# EAGLE design main (EAGLE 6.5.0)
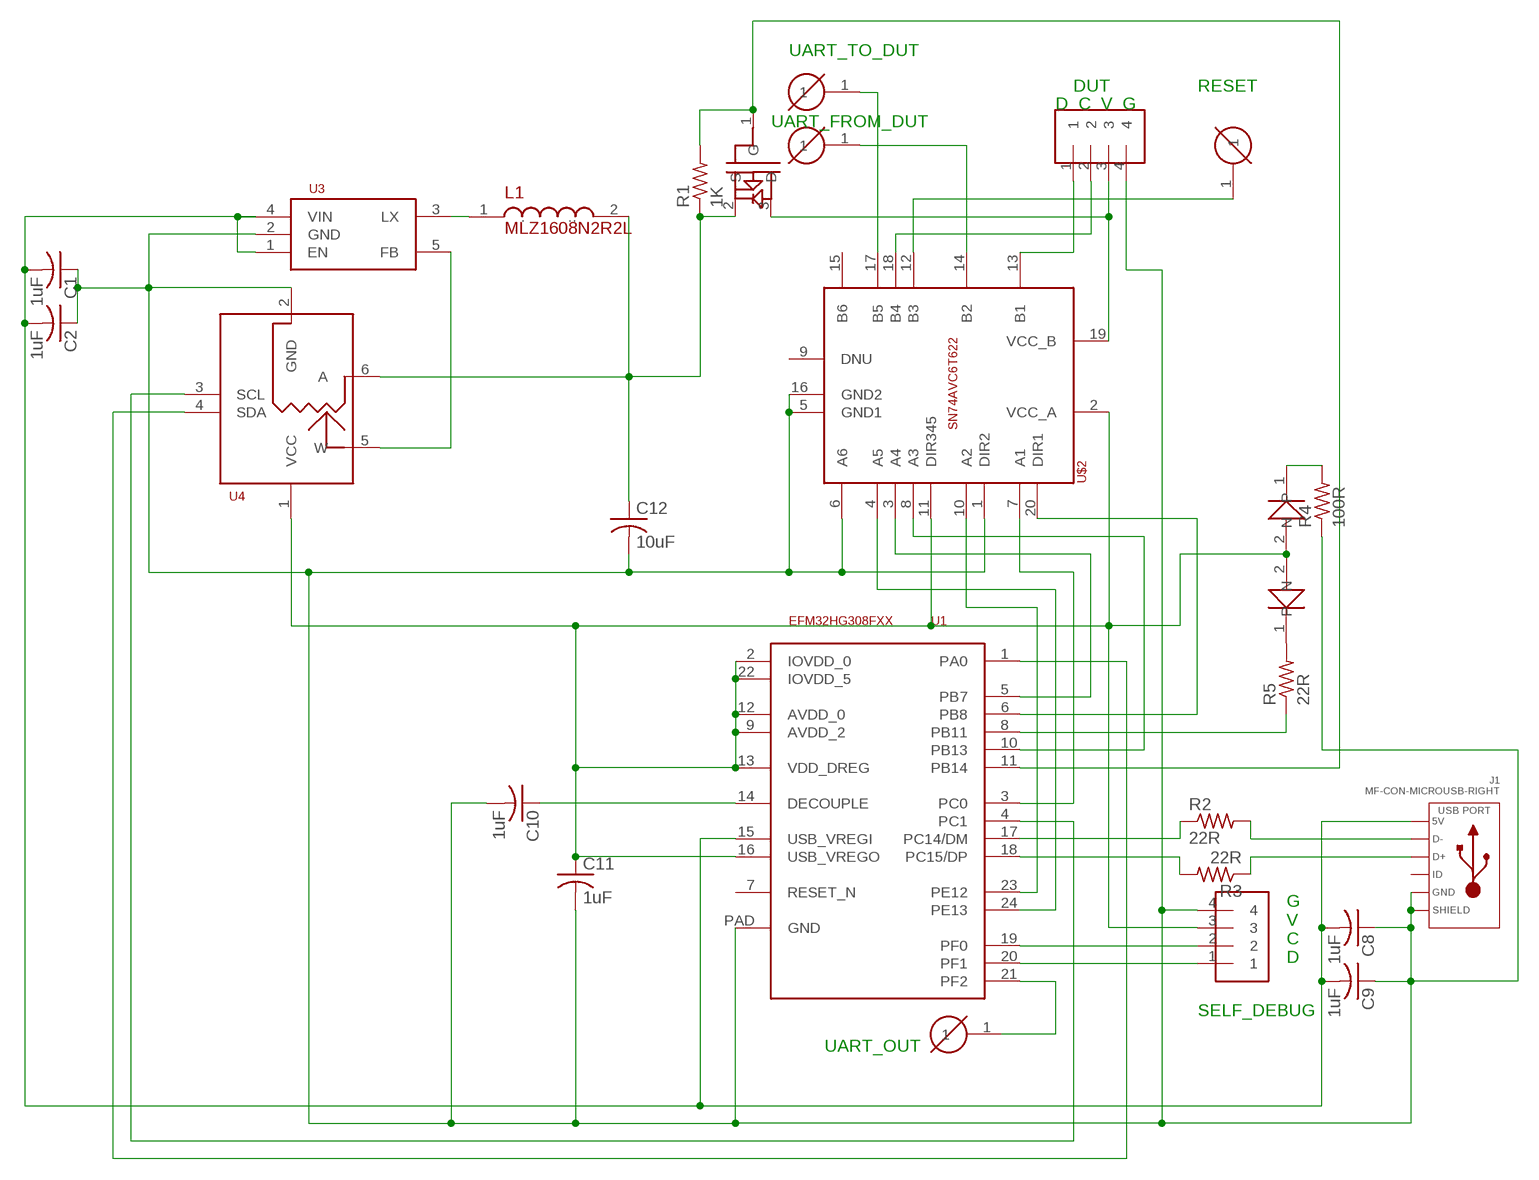
[diagram p0: schematic, sheet 1]

## Parts
C1  1uF  C-USC0402K  [C0402K]
C2  1uF  C-USC0402K  [C0402K]
C8  1uF  C-USC0402K  [C0402K]
C9  1uF  C-USC0402K  [C0402K]
C10  1uF  C-USC0402K  [C0402K]
C11  1uF  C-USC0402K  [C0402K]
C12  10uF  C-USC1206K  [C1206K]
CN_RST  PTH_PIN  [PTH_PIN]
CN_RX  PTH_PIN  [PTH_PIN]
CN_TX  PTH_PIN  [PTH_PIN]
CONN_OUT  PIN_HEADER_4X1POLARIZED  [PIN_HEADER_4X1_POLARIZED]
CONN_SELF  PIN_HEADER_4X1POLARIZED  [PIN_HEADER_4X1_POLARIZED]
D1-PWR  LED0805  [0805]
D2-ACT  LED0805  [0805]
J1  MF-CON-MICROUSB-RIGHT  USB_MICRO_RIGHT  [MICROUSB-RIGHT]
L1  MLZ1608N2R2L  [0603]
R1  1K  R-US_R0402  [R0402]
R2  22R  R-US_R0402  [R0402]
R3  22R  R-US_R0402  [R0402]
R4  100R  R-US_R0402  [R0402]
R5  22R  R-US_R0402  [R0402]
TP_UART_OUT  PTH_PIN  [PTH_PIN]
U1  EFM32HG308FXX  [QFN26-0.65]
U3  AP3417C  [SOT23]
U4  MCP4018  [SC-70-6]
U$1  PMV50UPE  [SOT23-3]
U$2  SN74AVC6T622  [VQFN-20]

## Nets
DEBUG_UART_DI: U1.23(PE12) U$2.10(A2)
DEBUG_UART_DO: U1.24(PE13) U$2.4(A5)
DUT_RESET: CN_RST.1 U$2.12(B3)
DUT_SWDCK: CONN_OUT.2 U$2.18(B4)
DUT_SWDIO: CONN_OUT.1 U$2.13(B1)
GND: C1.1 C2.1 C8.1 C9.1 C10.2 C11.2 C12.2 CONN_OUT.4 CONN_SELF.4 J1.5(GND) J1.S1(SLD) J1.S2(SLD) J1.S3(SLD) J1.S4(SLD) J1.S5(SLD) J1.S6(SLD) R4.1 U1.PAD(GND) U3.2(GND) U4.2(GND) U$2.1(DIR2) U$2.5(GND1) U$2.6(A6) U$2.16(GND2)
LED_ACT_1: R5.1 U1.8(PB11)
N$1: C10.1 U1.14(DECOUPLE)
N$4: TP_UART_OUT.1 U1.21(PF2)
N$6: D2-ACT.1(N) R5.2
N$7: D1-PWR.1(N) R4.2
OUT_RESET: U1.10(PB13) U$2.8(A3)
OUT_SWDCK: U1.5(PB7) U$2.3(A4)
OUT_SWDIO: U1.3(PC0) U$2.7(A1)
OUT_SWDIO_DIRCTL: U1.6(PB8) U$2.20(DIR1)
REG_FB: U3.5(FB) U4.5(W)
REG_LX: L1.1(.) U3.3(LX)
SCL: U1.4(PC1) U4.3(SCL)
SDA: U1.1(PA0) U4.4(SDA)
SELF_SWDCK: CONN_SELF.2 U1.19(PF0)
SELF_SWDIO: CONN_SELF.1 U1.20(PF1)
SUPPLY_POWER_EN: R1.2 U1.11(PB14) U$1.1(G)
UART_RX_FROM_DUT: CN_RX.1 U$2.14(B2)
UART_TX_TO_DUT: CN_TX.1 U$2.17(B5)
USB_DM: R2.1 U1.17(PC14/DM)
USB_DM_1: J1.2(D-) R2.2
USB_DP: R3.2 U1.18(PC15/DP)
USB_DP_1: J1.3(D+) R3.1
V_REGULATED_FOR_DUT: C12.1 L1.2(..) R1.1 U4.6(A) U$1.2(S)
VBUS: C1.2 C2.2 C8.2 C9.2 J1.1(5V) U1.15(USB_VREGI) U3.1(EN) U3.4(VIN)
VCC_3V3: C11.1 CONN_SELF.3 D1-PWR.2(P) D2-ACT.2(P) U1.2(IOVDD_0) U1.9(AVDD_2) U1.12(AVDD_0) U1.13(VDD_DREG) U1.16(USB_VREGO) U1.22(IOVDD_5) U4.1(VCC) U$2.2(VCC_A) U$2.11(DIR345)
VREF: CONN_OUT.3 U$1.3(D) U$2.19(VCC_B)
Unconnected: J1.4(ID) U1.7(RESET_N) U$2.9(DNU) U$2.15(B6)

## Notes on the sheet
- UART_TO_DUT
- DUT | RESET
- D  C  V  G
- UART_FROM_DUT
- G
  V
  C
  D
- SELF_DEBUG
- UART_OUT

## Library data of the parts
C1 C2 C8-C12 = rcl:C-US: CAPACITOR, American symbol
CN_RST CN_RX CN_TX TP_UART_OUT = dmitrygr:PTH_PIN
CONN_OUT CONN_SELF = dmitrygr:PIN_HEADER_4X1
D1-PWR D2-ACT = dmitrygr:LED
J1 = MF_Connectors:USB: Library: MF_Connectors Description: 5 Pin USB Connectors. SLD is the shield connection. Usually tied to ground through a small ferrite bead.; HOUSEPART: YES; MPN: MF-CON-MICROUSB-RIGHT; POPULATE: 1; URL: https://factory.macrofab.com/part/MF-CON-MICROUSB-RIGHT
L1 = dmitrygr:MLZ1608N2R2L
R1-R5 = rcl:R-US_: RESISTOR, American symbol
U1 = dmitrygr:EFM32HG308FXX
U3 = dmitrygr:AP3417C
U4 = dmitrygr:MCP4018
U$1 = dmitrygr:PMV50UPE
U$2 = dmitrygr:SN74AVC6T622

## Board
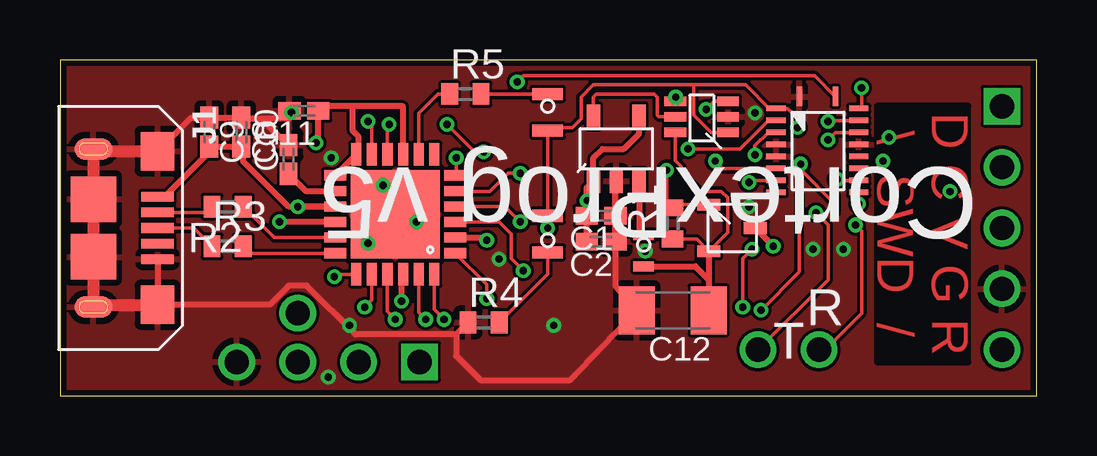
[diagram p1: board, top side]
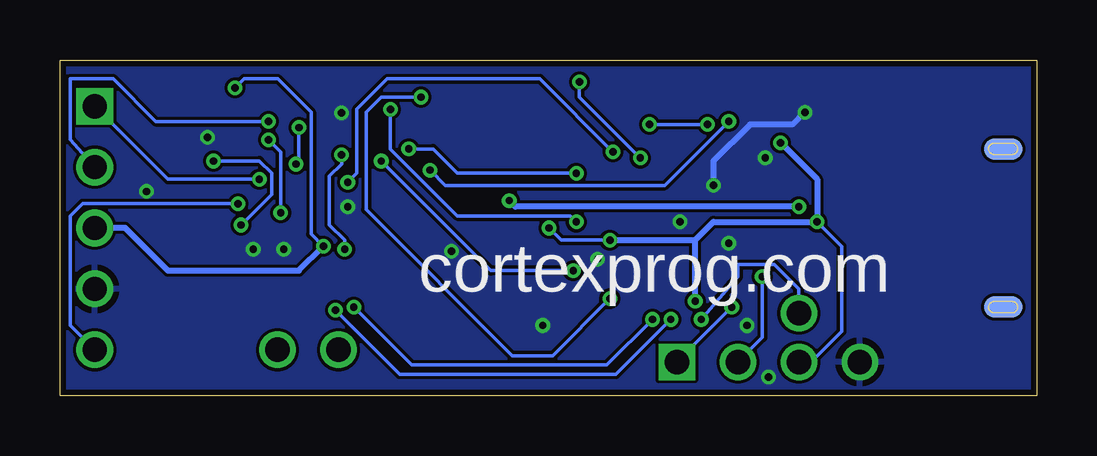
[diagram p2: board, bottom side, seen from below]

Size 40.69 x 14.02 mm. Coordinates in mm from the lower left corner, seen from the top.
Outline: 0,14.02 0,0 40.69,0 40.69,14.02 0,14.02
Copper layers (1*16): Top 0.035mm / dielectric 1.5mm / Bottom 0.035mm
Design rules "MF_Standard_2_Layer": minimum track width 5mil, minimum drill 12mil, track to track 5mil, track to pad 5mil, pad to pad 5mil, via to via 5mil, smd to smd 0mil, copper to edge 10mil, drill to drill 10mil, minimum pad ring 6mil, minimum via ring 6mil, stop-mask expansion 2mil, vias tented up to drill 25mil, thermal gap 10mil

### Footprints (pad centres in the part's own frame; a part is rotated, then mirrored left to right if it is on the bottom)
C0402K = smd 0.925 x 0.74: 1 -0.6,0; 2 0.6,0
C1206K = smd 1.5 x 2: 1 -1.5,0; 2 1.5,0
PTH_PIN = drill 1.016: 1 0,0
PIN_HEADER_4X1_POLARIZED = drill 1.016 square: 1 0,5.08 | drill 1.016: 2 0,2.54; 3 0,0; 4 0,-2.54
0805 = smd 0.508 x 1.27: 1 -0.762,0; 2 0.762,0
MICROUSB-RIGHT = smd 0.4 x 1.35: 1 -1.3,1.27; 2 -0.65,1.27; 3 0,1.27; 4 0.65,1.27; 5 1.3,1.27 | smd 0.9 x 1.6: S1 -3.3,-1.4; S2 3.3,-1.4 | smd 1.6 x 1.4: S3 -3.2,1.27; S4 3.2,1.27 | smd 1.9 x 1.9: S5 -1.2,-1.405; S6 1.2,-1.405 | smd 0.9 x 1.6 bottom: S7 -3.3,-1.4; S8 3.3,-1.4
0603 = smd 0.4 x 0.85: 1 -0.65,0; 2 0.65,0
R0402 = smd 0.7 x 0.9: 1 -0.65,0; 2 0.65,0
QFN26-0.65 = smd 0.92 x 0.42: 1 -2.5,1.625; 2 -2.5,0.975; 3 -2.5,0.325; 4 -2.5,-0.325; 5 -2.5,-0.975; 6 -2.5,-1.625; 13 2.5,-1.625; 14 2.5,-0.975; 15 2.5,-0.325; 16 2.5,0.325; 17 2.5,0.975; 18 2.5,1.625 | smd 0.42 x 0.92: 7 -1.625,-2.5; 8 -0.975,-2.5; 9 -0.325,-2.5; 10 0.325,-2.5; 11 0.975,-2.5; 12 1.625,-2.5; 19 1.625,2.5; 20 0.975,2.5; 21 0.325,2.5; 22 -0.325,2.5; 23 -0.975,2.5; 24 -1.625,2.5 | smd 3.7 x 3.7: PAD 0,0
SOT23 = smd 0.55 x 1: 1 -0.95,-1.35; 2 0,-1.35; 3 0.95,-1.35; 4 0.95,1.35; 5 -0.95,1.35
SC-70-6 = smd 0.9 x 0.4: 1 -1.1,0.65; 2 -1.1,0; 3 -1.1,-0.65; 4 1.1,-0.65; 5 1.1,0; 6 1.1,0.65
SOT23-3 = smd 0.48 x 0.95: 1 0.97,0.97; 2 -0.97,0.97; 3 0,-0.97
VQFN-20 = smd 0.8 x 0.23: 1 -2.25,-0.75; 10 2.25,-0.75; 11 2.25,0.75; 20 -2.25,0.75 | smd 0.23 x 0.8: 2 -1.75,-1.725; 3 -1.25,-1.725; 4 -0.75,-1.725; 5 -0.25,-1.725; 6 0.25,-1.725; 7 0.75,-1.725; 8 1.25,-1.725; 9 1.75,-1.725; 12 1.75,1.725; 13 1.25,1.725; 14 0.75,1.725; 15 0.25,1.725; 16 -0.25,1.725; 17 -0.75,1.725; 18 -1.25,1.725; 19 -1.75,1.725

### Placement (x,y rotation side)
C1  22.54,7.52 180 top
C2  22.54,6.44 180 top
C8  7.56,11.01 270 top
C9  6.22,11.01 270 top
C10  9.53,9.87 90 top
C11  10.16,11.9 180 top
C12  25.53,3.58 180 top
CN_RST  39.24,1.93 270 top
CN_RX  31.62,1.93 270 top
CN_TX  29.08,1.93 270 top
CONN_OUT  39.24,7.01 0 top
CONN_SELF  9.91,1.42 270 top
D1-PWR  20.32,6.76 90 top
D2-ACT  20.32,11.84 270 top
J1  2.79,7.01 270 top
L1  24.32,6.06 270 top
R1  25.53,7.2 90 top
R2  6.99,7.9 180 top
R3  6.99,6.25 0 top
R4  17.65,3.07 0 top
R5  16.89,12.6 0 top
TP_UART_OUT  9.91,3.45 270 top
U1  13.97,7.58 180 top
U3  23.18,10.31 0 top
U4  26.73,11.65 180 top
U$1  28,7.01 90 top
U$2  31.56,10.25 270 top

### Tracks (layer width: path | path; a pad name or v marks a point on that pad's centre or on a via)
DEBUG_UART_DI  (via drill 0.3)
  Top 0.152: U1.23 14.95,3.5 v15.24,3.2 | v29.21,3.58 30.81,5.18 U$2.10
  Bottom 0.152: v15.24,3.2 17.53,0.91 26.54,0.91 v29.21,3.58
DEBUG_UART_DO  (via drill 0.3)
  Top 0.152: U1.24 15.6,3.61 v16,3.2 | v28.96,10.06 28.96,10.44 29.52,11 U$2.4 | v28.83,6.12 28.45,5.74 v28.45,3.71
  Bottom 0.152: v16,3.2 17.91,1.29 26.04,1.29 v28.45,3.71 | v28.96,10.06 28.96,9.68 29.46,9.17 29.46,7.14 28.83,6.5 v28.83,6.12
DUT_RESET  (via drill 0.3)
  Top 0.152: v33.27,8.03 33.28,8.04 U$2.12
  Bottom 0.152: CN_RST.1 40.26,2.95 40.26,7.52 39.75,8.03 v33.27,8.03
DUT_SWDCK  (via drill 0.3)
  Top 0.152: v32,11.46 32.05,11.5 U$2.18
  Bottom 0.152: CONN_OUT.2 40.26,10.69 40.26,13.23 38.48,13.23 36.7,11.46 v32,11.46
DUT_SWDIO  (via drill 0.3)
  Top 0.152: v32.38,9.04 32.56,9 U$2.13
  Bottom 0.152: CONN_OUT.1 36.2,9.04 v32.38,9.04
GND  (via drill 0.3)
  Top 0.152: R4.1 17,3.06 16.51,2.56
  Top 0.254: J1.5 J1.S4 8.74,3.81 9.53,4.6 10.29,4.6 12.32,2.56 16.5,2.56 R4.1 | J1.S3 5.46,11.61 C9.1 C8.1 7.58,11.58 8.38,11.58 | 8.38,11.58 9.5,10.47 C10.2 | 8.38,11.58 9.56,11.58 C11.2 9.62,11.84 v9.65,11.84 | U1.PAD 13.53,8.03 v13.46,8.79 | C12.2 24.41,3.45 | U3.2 23.14,8.93 C1.1 C2.1 23.14,4.59 C12.2 | 16.51,2.56 16.51,1.68 17.53,0.66 21.23,0.66 C12.2
  Top 0.508: J1.S6 J1.S5 J1.S1 1.39,10.21 J1.S3 | J1.S6 J1.S2 | J1.S6 1.39,3.81 J1.S4
  Bottom 0.254: v9.65,11.84 10.16,11.33 11.94,11.33 13.46,9.8 v13.46,8.79
  other vias: 12.06,2.95 11.18,0.79 20.57,2.95 31.37,6.12 32.64,6.12 28.7,7.9 14.86,7.26 11.3,9.93 37.08,8.53 24.38,6.05 12.83,6.38 18.29,5.71 34.54,10.79 28.96,11.81
  pour Top: 0.13,13.74 40.51,13.74 40.51,0.28 0.13,0.28
  pour Bottom: 0.13,13.74 40.51,13.74 40.51,0.28 0.13,0.28
LED_ACT_1
  Top 0.152: U1.8 14.95,11.79 15.75,12.6 R5.1
N$1
  Top 0.254: C10.1 10.24,8.56 U1.14
N$4  (via drill 0.3)
  Top 0.152: U1.21 13.64,3.52 v13.97,3.2
  Bottom 0.152: TP_UART_OUT.1 9.91,4.47 10.92,5.49 12.45,5.49 12.45,4.98 v13.97,3.2
N$6
  Top 0.152: R5.2 D2-ACT.1
N$7
  Top 0.152: R4.2 20.32,5.09 D1-PWR.1
OUT_RESET  (via drill 0.3)
  Top 0.152: U$2.8 28.79,9 v28.7,8.91 | v17.65,10.19 17.27,10.19 v16.13,11.33 | U1.10 13.64,11.26 v13.72,11.33
  Bottom 0.152: v28.7,8.91 28.32,9.3 28.32,11.96 27.05,13.23 20.7,13.23 v17.65,10.19 | 16,11.33 v16.13,11.33 v13.72,11.33
OUT_SWDCK  (via drill 0.3)
  Top 0.152: U1.5 16.49,8.53 17.91,8.53 18.67,9.3 v19.18,9.3 | v26.16,10.31 28.32,10.31 29.51,11.5 U$2.3
  Bottom 0.152: v26.16,10.31 25.15,10.31 24.13,9.3 v19.18,9.3
OUT_SWDIO  (via drill 0.3)
  Top 0.152: v19.3,5.23 18.8,5.74 18.8,6.76 18.3,7.26 U1.3 | v27.3,9.8 27.61,9.5 U$2.7
  Bottom 0.152: v19.3,5.23 22.73,5.23 v27.3,9.8
OUT_SWDIO_DIRCTL  (via drill 0.3)
  Top 0.152: U$2.20 31.45,13.36 19.3,13.36 v19.05,13.11 | v16.51,9.93 16.51,9.25 U1.6
  Bottom 0.152: v19.05,13.11 19.05,12.47 v16.51,9.93
REG_FB
  Top 0.152: U4.5 24.96,11.65 24.89,11.71 24.89,12.47 24.77,12.6 22.35,12.6 22.23,12.47 22.23,12.22 22.23,12.09 U3.5
REG_LX
  Top 0.254: U3.3 24.13,6.71 L1.1
SCL  (via drill 0.3)
  Top 0.152: U4.3 27.26,12.3 v26.92,11.96 | v19.18,7.26 18.54,7.91 U1.4
  Bottom 0.152: v26.92,11.96 26.92,10.31 24.13,7.52 19.43,7.52 v19.18,7.26
SDA  (via drill 0.3)
  Top 0.152: U4.4 25.83,12.3 v25.65,12.47 | U1.1 17.78,4.65 v17.78,4.06
  Bottom 0.152: v25.65,12.47 27.3,12.47 27.94,11.84 27.94,7.77 21.84,1.68 20.17,1.68 v17.78,4.06
SELF_SWDCK  (via drill 0.3)
  Top 0.152: U1.19 11.53,5.08 v11.43,4.98
  Bottom 0.152: v11.43,4.98 11.43,2.44 CONN_SELF.2
SELF_SWDIO  (via drill 0.3)
  Top 0.152: U1.20 12.99,4 v12.7,3.71
  Bottom 0.152: v12.7,3.71 CONN_SELF.1
SUPPLY_POWER_EN  (via drill 0.3)
  Top 0.152: U$1.1 25.66,7.98 R1.2 25.27,8.11 v25.27,9.42 | v12.83,11.46 12.99,11.29 U1.11
  Bottom 0.152: v25.27,9.42 24.64,8.79 15.49,8.79 v12.83,11.46
UART_RX_FROM_DUT  (via drill 0.3)
  Top 0.152: U$2.14 33.98,9.5 v34.29,9.8 | v33.15,7.14 33.4,6.88 33.4,3.45 31.88,1.93 CN_RX.1
  Bottom 0.152: v34.29,9.8 32.38,9.8 31.88,9.3 31.88,8.41 v33.15,7.14
UART_TX_TO_DUT  (via drill 0.3)
  Top 0.152: v32,10.69 32.31,11 U$2.17 | v31.5,7.64 32,7.14 32,4.85 CN_TX.1
  Bottom 0.152: v31.5,7.64 31.5,10.19 v32,10.69
USB_DM
  Top 0.152: R2.1 8.93,6.61 U1.17
USB_DM_1
  Top 0.152: J1.2 6.1,7.66 R2.2
USB_DP
  Top 0.152: R3.2 7.93,5.96 U1.18
USB_DP_1
  Top 0.152: J1.3 5.57,7.01 R3.1
V_REGULATED_FOR_DUT
  Top 0.152: R1.1 26.52,6.55 U$1.2 27.81,6.82 27.81,8.28 27.56,8.53 26.67,8.53 25.89,9.32 25.89,9.57 25.63,9.82 U4.6
  Top 0.254: U$1.2 27.03,4.85 | 27.03,4.85 27.03,3.83 C12.1 | 27.03,4.85 26.48,5.41 L1.2
VBUS  (via drill 0.3)
  Top 0.254: J1.1 4.35,8.31 6.22,10.19 C9.2 C8.2 7.62,10.35 7.62,9.8 9.52,7.91 U1.15 v9.91,7.91 v9.91,7.9 | C2.2 C1.2 | C1.2 21.94,8.68 U3.1 22.23,9.93 22.61,10.31 23.5,10.31 24.13,10.95 U3.4 | C1.2 21.94,8.12 v21.97,8.15
  Bottom 0.254: v9.91,7.9 21.72,7.9 v21.97,8.15
VCC_3V3  (via drill 0.3)
  Top 0.152: v20.32,7.01 D1-PWR.2 D2-ACT.2 20.45,11.2 21.34,11.2 21.72,11.58 21.72,12.47 22.23,12.98 26.42,12.98 | U$2.11 30.86,9.45 v30.86,9.68 | v30.73,11.2 30.73,11.58 30.32,12 U$2.2 29.55,12 28.57,12.98 26.42,12.98 | 28.01,11.07 U4.1 27.13,11 26.42,11.71 26.42,12.98
  Top 0.254: U1.9 14.29,12.09 12.19,12.09 | 12.19,12.09 10.95,12.09 C11.1 10.76,10.66 v10.67,10.57 | U1.13 U1.12 12.35,10.31 12.45,10.42 12.45,10.82 12.19,11.07 12.19,12.09 | U1.16 v9.14,7.26 | U1.22 14.22,5.01 v14.22,3.96 | U1.2 17.78,6.61 v17.78,6.5
  Bottom 0.152: v20.32,7.01 19.81,6.5 v17.78,6.5 | CONN_SELF.3 9.4,1.42 8.13,2.69 8.13,6.25 v9.14,7.26 | v30.86,9.68 30.73,9.8 v30.73,11.2
  Bottom 0.254: v14.22,3.96 14.22,6.5 | 14.22,6.5 13.46,7.26 v9.14,7.26 9.14,9.04 v10.67,10.57 | v17.78,6.5 14.22,6.5
VREF  (via drill 0.3)
  Top 0.152: U$2.19 33.4,12.12 v33.4,12.85
  Top 0.254: U$1.3 29.72,6.27 v29.72,6.25
  Bottom 0.152: v33.4,12.85 33.02,13.23 31.62,13.23 30.23,11.84 30.23,6.76 v29.72,6.25
  Bottom 0.254: v29.72,6.25 30.73,5.23 36.2,5.23 37.97,7.01 CONN_OUT.3

### Text on the board
Top: D C V G R / \\ SWD /
tPlace: CortexProg v5 | R | T
bPlace: cortexprog.com
tStop: D C V G R / \\ SWD /